# EasyEDA schematic SCH_ymu762 MegaMod_2022-10-14.json

## Sheets
1 Main: TITLE: Sheet_1; REV: 1.0; Date: 2021-11-16; Sheet: 1/1; Company: Your Company
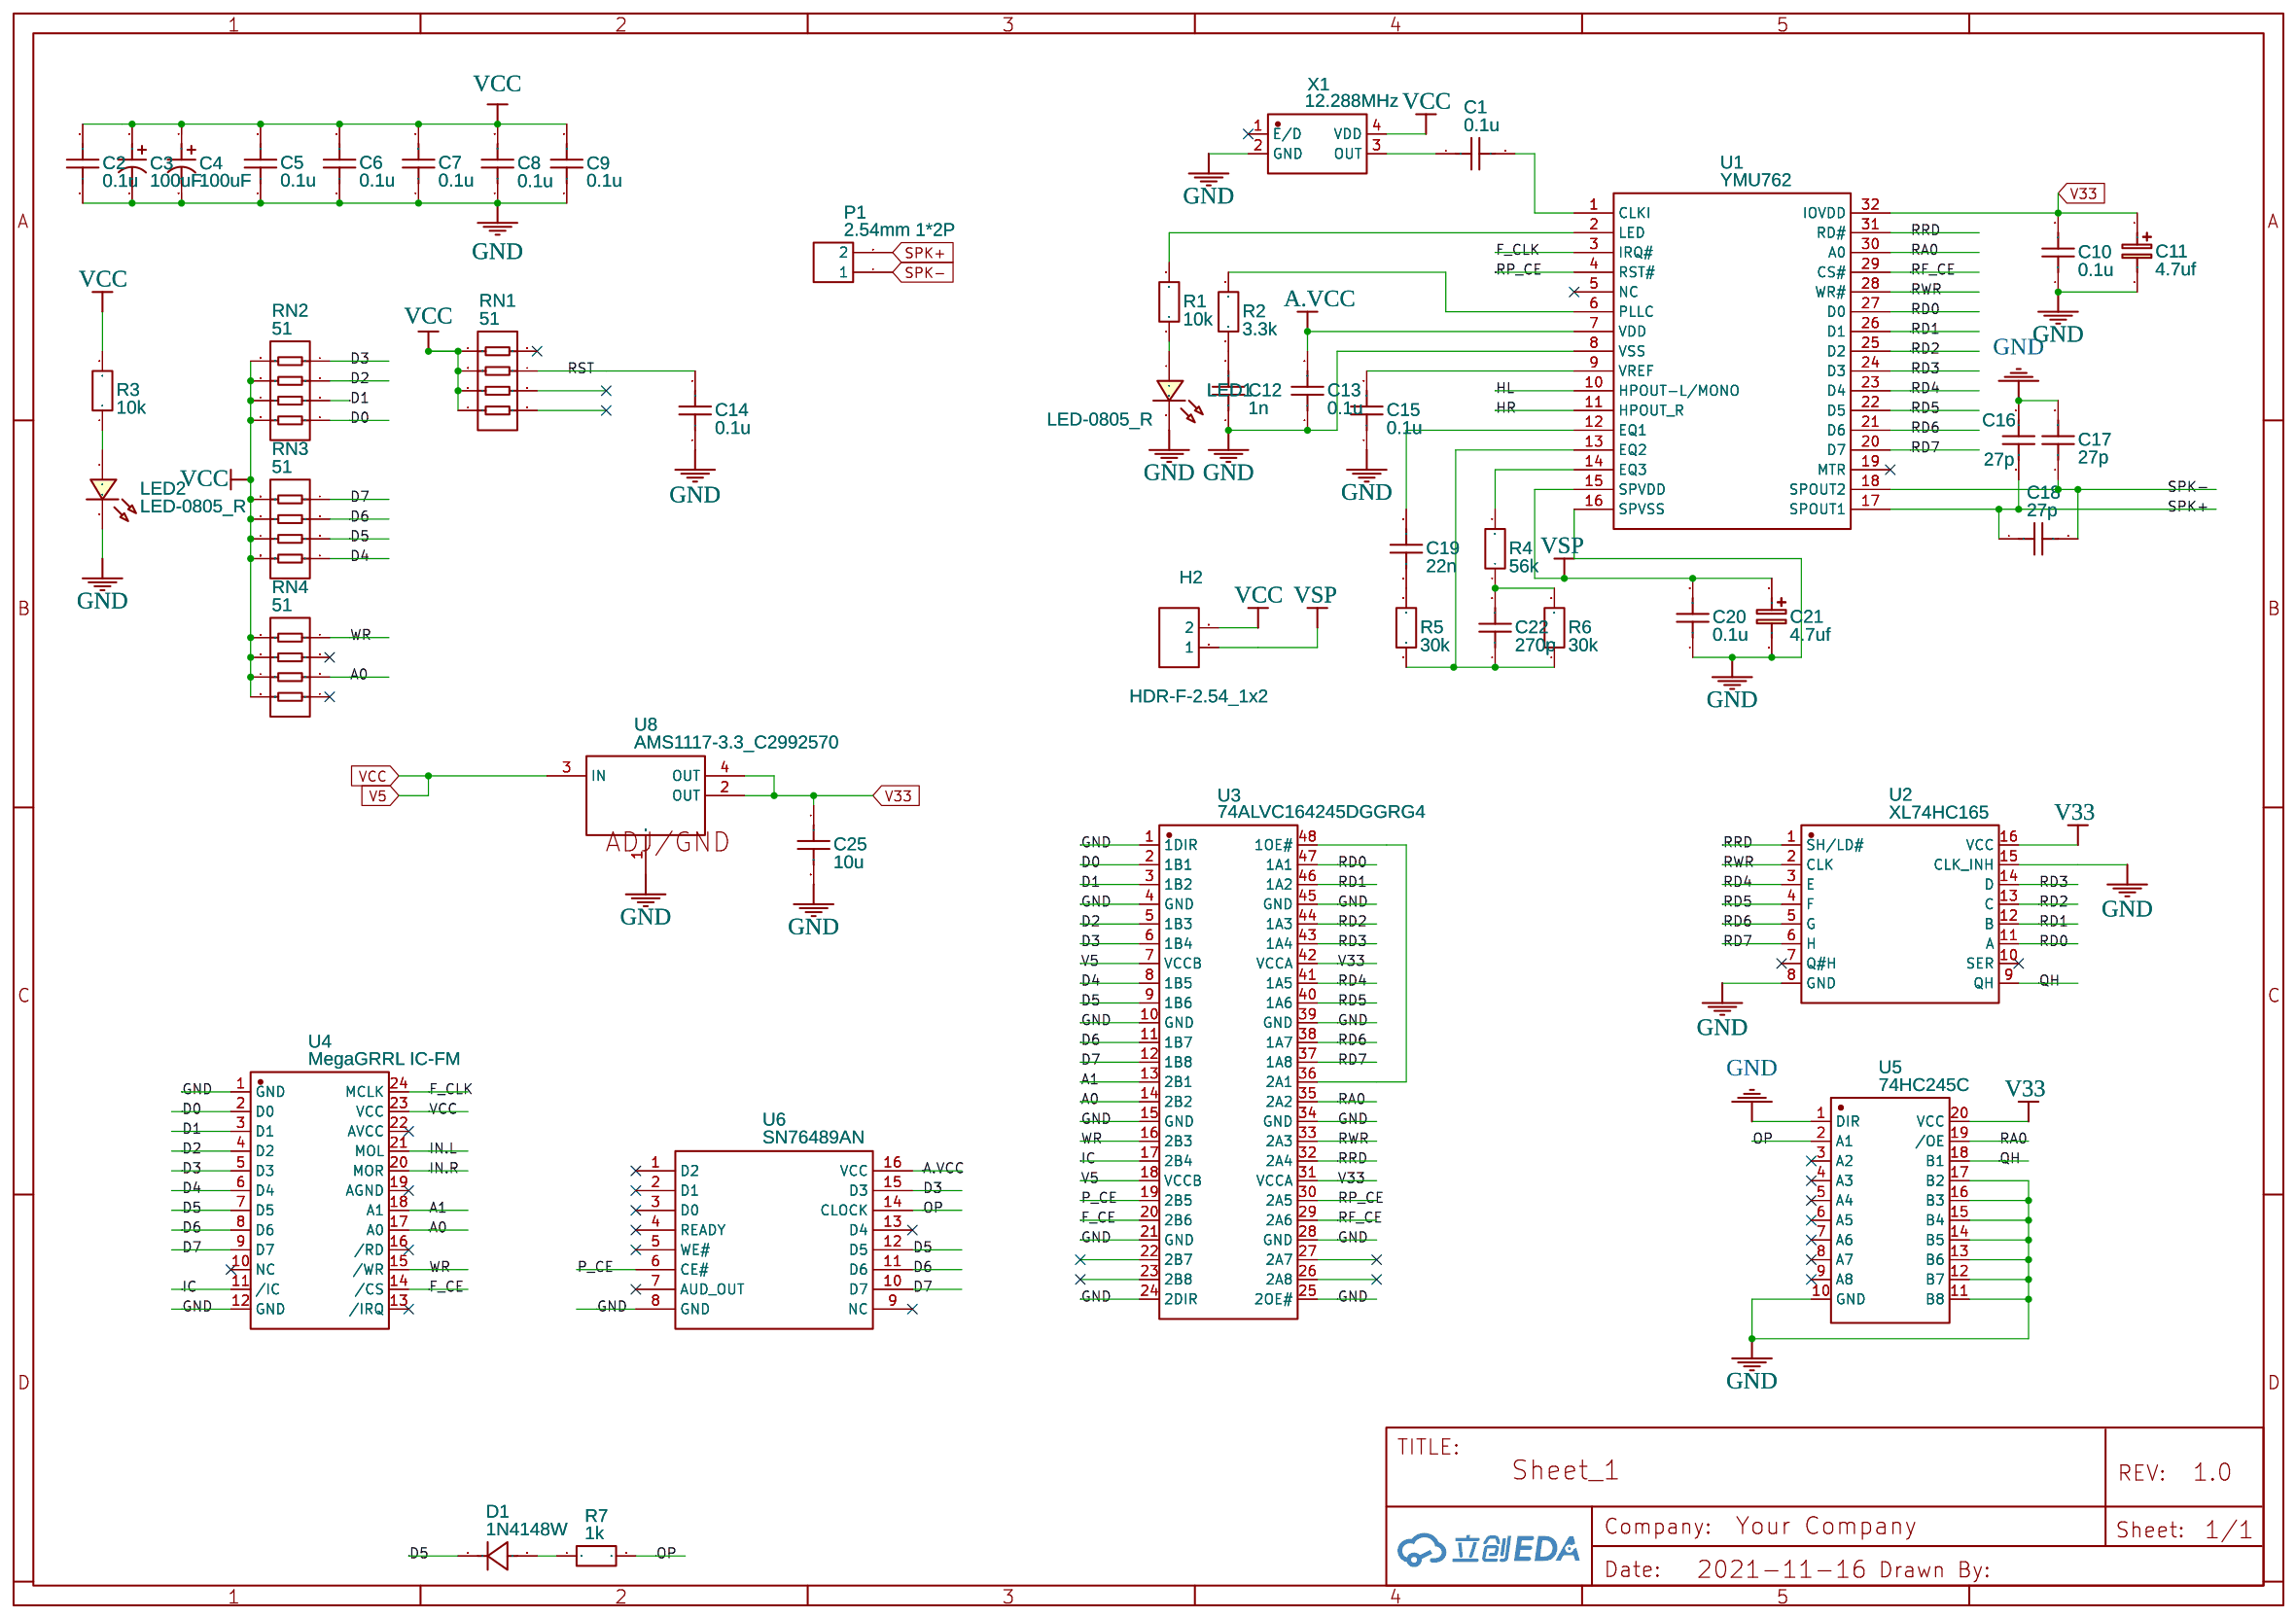
[diagram p0: Main]
2 OUT: TITLE: Sheet_2; Date: 2022-10-14; Drawn By: Denjhang
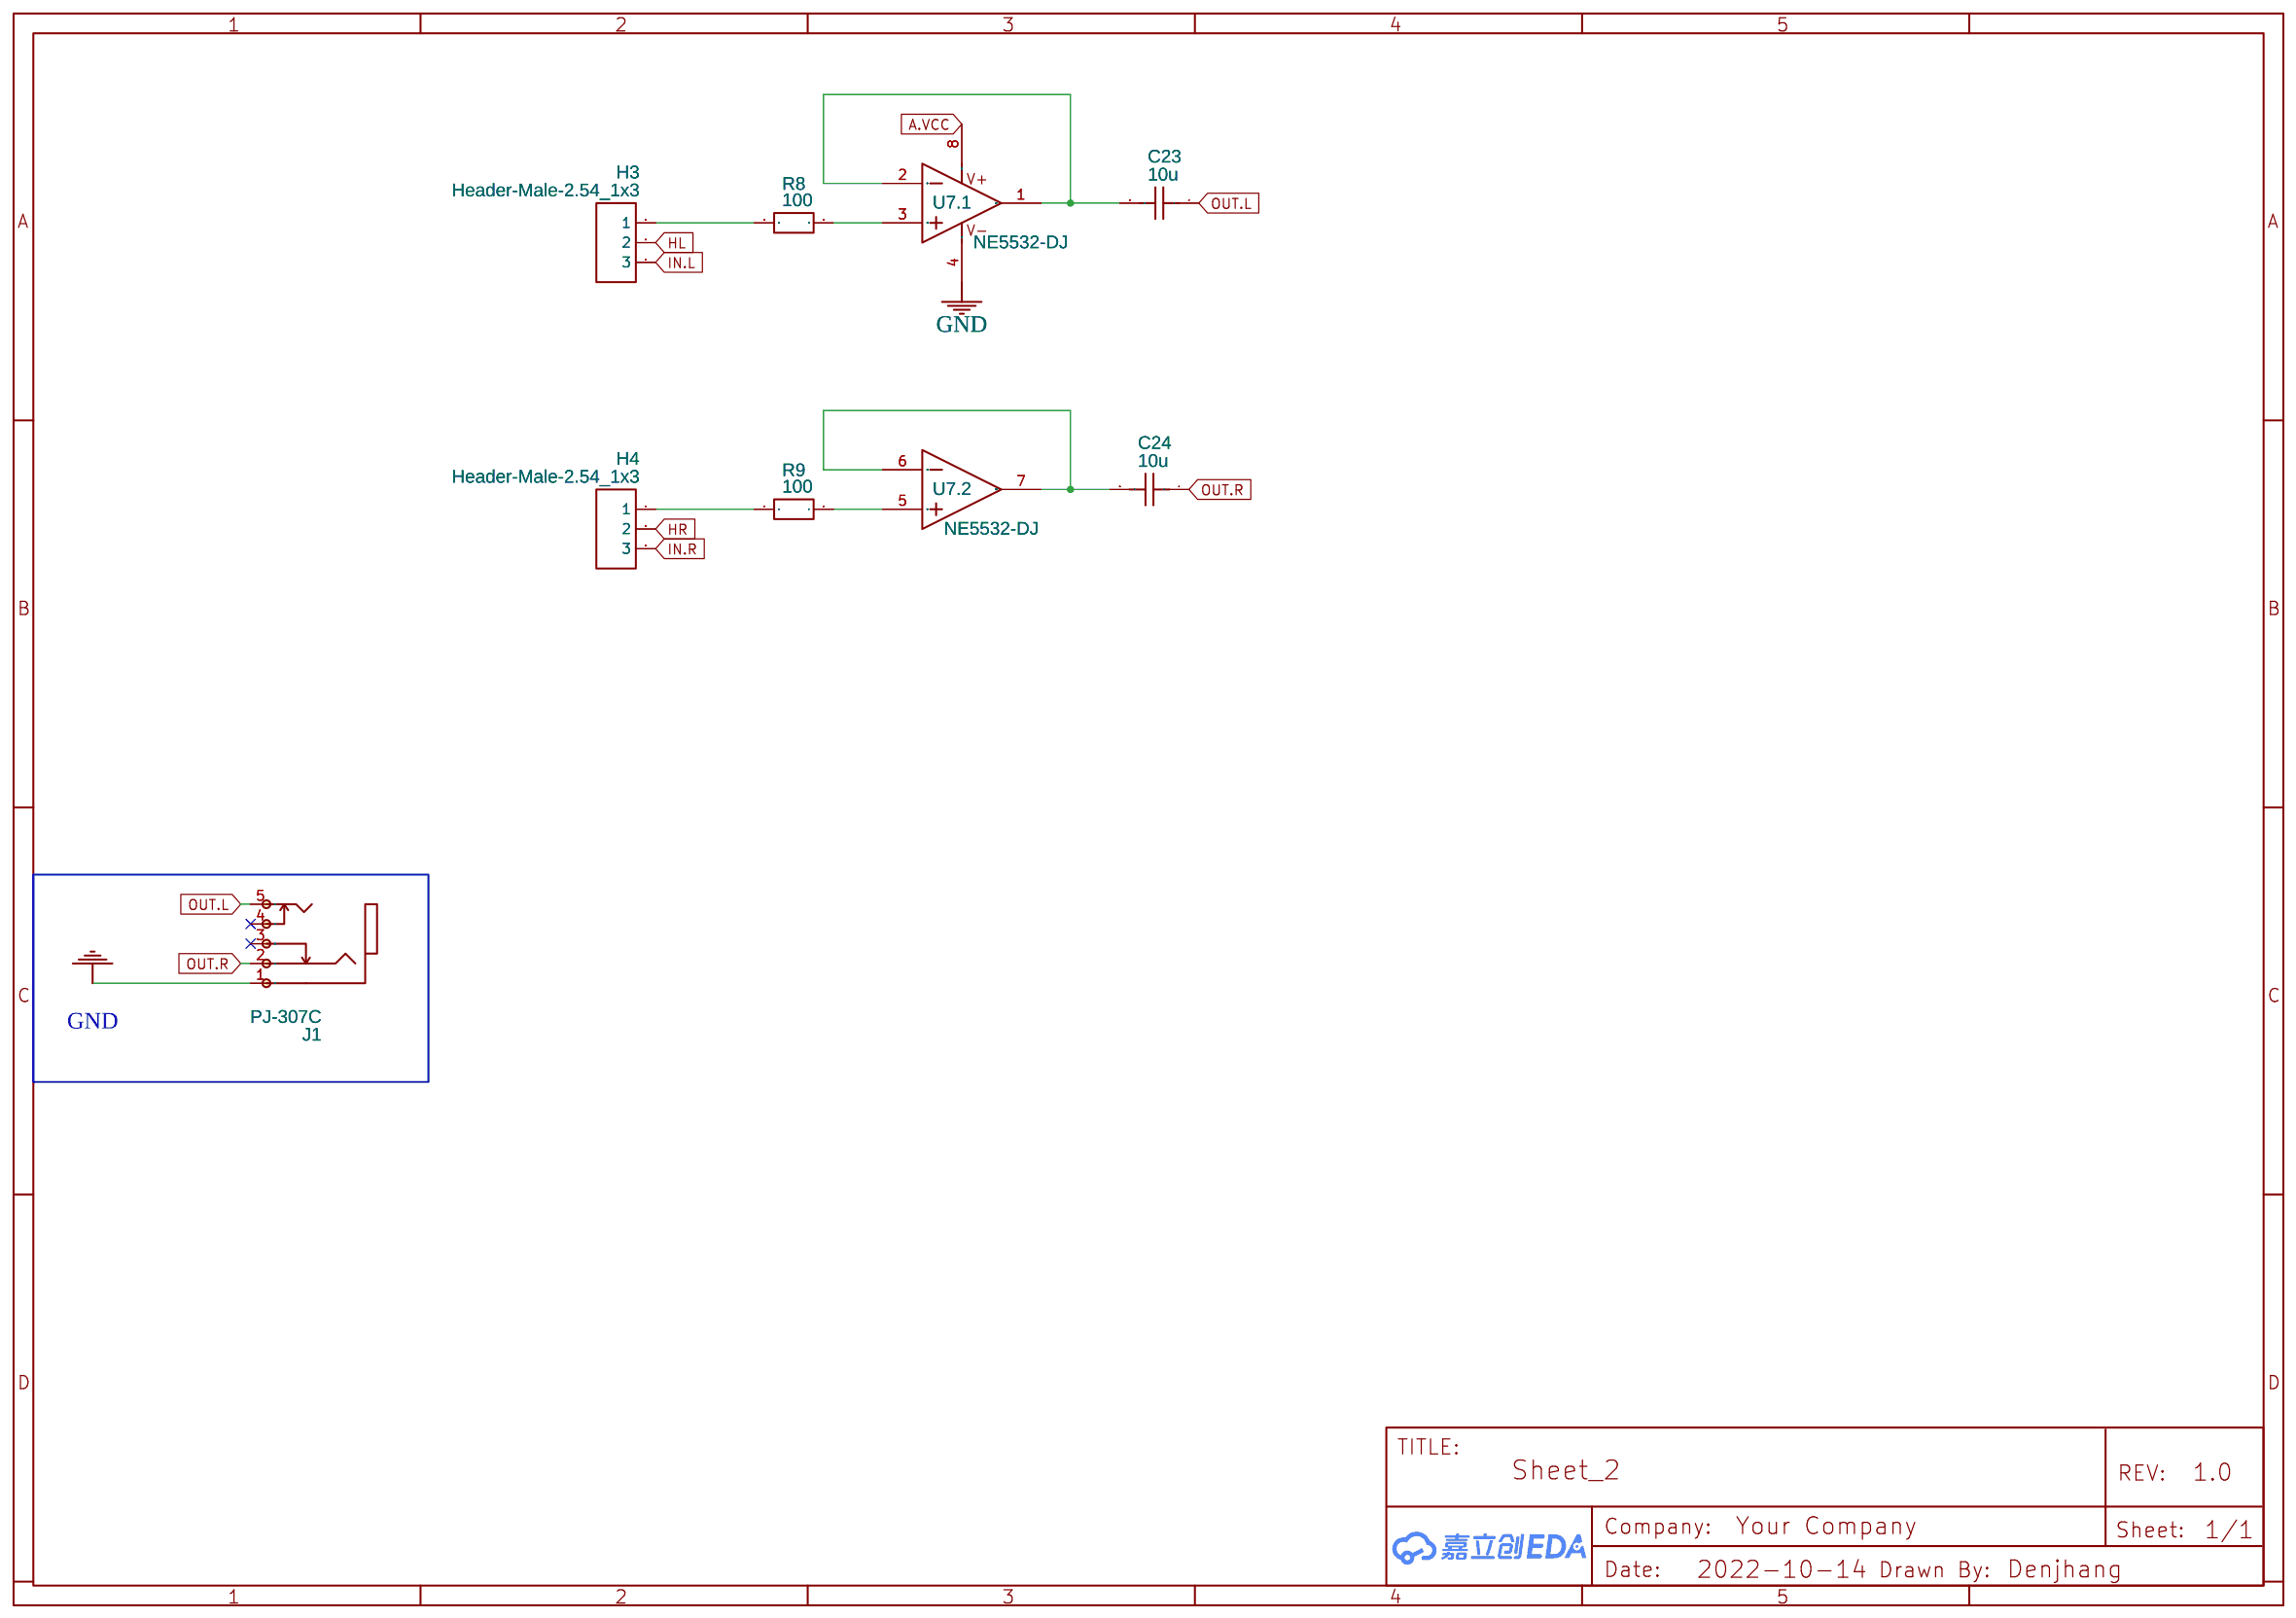
[diagram p1: OUT]

## Parts
sheet Main
C1  0.1u  [C0805]
C2  0.1u  [C0805]
C3  100uF  [CAP-SMD_L6.6-W6.6]
C4  100uF  [CAP-SMD_L6.6-W6.6]
C5  0.1u  [C0805]
C6  0.1u  [C0805]
C7  0.1u  [C0805]
C8  0.1u  [C0805]
C9  0.1u  [C0805]
C10  0.1u  [C0805]
C11  4.7uf  [C1206]
C12  1n  [C0805]
C13  0.1u  [C0805]
C14  0.1u  [C0805]
C15  0.1u  [C0805]
C16  27p  [C0805]
C17  27p  [C0805]
C18  27p  [C0805]
C19  22n  [C0805]
C20  0.1u  [C0805]
C21  4.7uf  [C1206]
C22  270p  [C0805]
C25  10u  [C0805]
D1  1N4148W  [SOD-123_L2.8-W1.8-LS3.7-RD]
H2  HDR-F-2.54_1x2  [JP]
LED1  LED-0805_R  [LED0805_RED]
LED2  LED-0805_R  [LED0805_RED]
P1  2.54mm 1*2P  [HDR-TH_2P-P2.54-V-M]
R1  10k  [R0805]
R2  3.3k  [R0805]
R3  10k  [R0805]
R4  56k  [R0805]
R5  30k  [R0805]
R6  30k  [R0805]
R7  1k  [R0805]
RN1  51  [RES-ARRAY-SMD_8P-L3.2-W1.6-P0.80-BL-1]
RN2  51  [RES-ARRAY-SMD_8P-L3.2-W1.6-P0.80-BL-1]
RN3  51  [RES-ARRAY-SMD_8P-L3.2-W1.6-P0.80-BL-1]
RN4  51  [RES-ARRAY-SMD_8P-L3.2-W1.6-P0.80-BL-1]
U1  YMU762  [C-PK32QP-2]
U2  XL74HC165  [SOP-16_L9.9-W3.9-P1.27-LS6.1-BL]
U3  74ALVC164245DGGRG4  [TSSOP-48_L12.5-W6.1-P0.50-LS8.1-BL]
U4  MegaGRRL IC-FM  [DIP-24_L32.0-W13.8-P2.54-LS15.6-BL]
U5  74HC245C  [TSSOP-20_L6.5-W4.4-P0.65-LS6.4-BL]
U6  SN76489AN  [DIP-16_L20.4-W5.8-P2.54-LS7.6-BL]
U8  AMS1117-3.3_C2992570  [SOT-223-3_L6.4-W3.5-P2.30-LS7.0-BR]
X1  12.288MHz  [OSC-SMD_4P-L7.0-W5.0-BL]
sheet OUT
C23  10u  [C0805]
C24  10u  [C0805]
H3  Header-Male-2.54_1x3  [HDR-TH_3P-P2.54-V-M-1]
H4  Header-Male-2.54_1x3  [HDR-TH_3P-P2.54-V-M-1]
J1  PJ-307C  [AUDIO-TH_PJ307C]
R8  100  [R0805]
R9  100  [R0805]
U7  NE5532-DJ  [DIP-8_L9.4-W6.4-P2.54-LS9.1-BL]  (sections 1,2)

## Library data of the parts
C1 C2 C5-C10 C12-C20 C22-C25 = C_0805_US: Contributor: LCEDA_Lib
C3 C4 = RVT100UF35V67RV0034: Supplier: LCSC; Supplier Part: C2836442; Manufacturer: KNSCHA(科尼盛); JLCPCB Part Class: Extended Part; Contributor: LCSC
C11 C21 = C_Tan_SMD_A_EU: Contributor: LCEDA_Lib
D1 = 1N4148W: Supplier: LCSC; Supplier Part: C1884539; Manufacturer: YFW佑风微; Contributor: Denjhang; JLCPCB Part Class: Extended Part
H2 = HDR-F-2.54_1x2: Supplier Part: C49661; Supplier: LCSC; Contributor: LCEDA_Lib
LED1 LED2 = LED-0805_R: Manufacturer: EVERLIGHT(台湾亿光); Manufacturer Part: 17-21SURC/S530-A3/TR8; Supplier Part: C72037; Contributor: LCEDA_Lib
P1 = 2.54mm 1*2P: Supplier: LCSC; Manufacturer: ReliaPro; Supplier Part: C36717; JLCPCB Part Class: Extended Part
R1-R9 = R_0805_EU: Contributor: LCEDA_Lib
RN1-RN4 = YC164-JR-0751RL: Supplier: LCSC; Supplier Part: C13474; Manufacturer: YAGEO; Contributor: LCSC; JLCPCB Part Class: Extended Part
U1 = YMU762: Contributor: re1mu
U2 = XL74HC165: Supplier: LCSC; Supplier Part: C609780; Manufacturer: XINLUDA; Contributor: LCSC; JLCPCB Part Class: Extended Part
U3 = 74ALVC164245DGGRG4: Supplier: LCSC; Supplier Part: C2677427; Manufacturer: TI(德州仪器); Contributor: LCSC; JLCPCB Part Class: Extended Part
U4 = MegaGRRL IC-FM: Supplier Part: C707077; Manufacturer: YAMAHA; Manufacturer Part: YM2612; Contributor: Denjhang; JLCPCB SMD: Yes; SMT Type: Extend
U5 = 74HC245C: Supplier: LCSC; Manufacturer: FM; Supplier Part: C126198; JLCPCB Part Class: Extended Part
U6 = SN76489AN: Manufacturer: Texas Instruments; Contributor: re1mu
U8 = AMS1117-3.3_C2992570: Supplier: LCSC; Supplier Part: C2992570; Manufacturer: 国芯佳品; Manufacturer Part: AMS1117-3.3; link: https://atta.szlcsc.comnull; Contributor: lcsc; JLCPCB Part Class: Extended Part
X1 = OT705012.288MJBA4SL: Supplier: LCSC; Supplier Part: C669092; Manufacturer: Yangxing Tech; Contributor: LCSC
H3 H4 = Header-Male-2.54_1x3: Supplier: LCSC; Manufacturer: BOOMELE; Manufacturer Part: Header2.54mm 1*3P; Supplier Part: C49257; JLCPCB Part Class: Extended Part
J1 = PJ-307C: Supplier: LCSC; Manufacturer: BOOMELE; Supplier Part: C16684; JLCPCB Part Class: Extended Part
U7 = NE5532-DJ: tags: Audio Operational Amplifier; Supplier Part: C5326; Supplier: LCSC; Manufacturer: TI; Manufacturer Part: NE5532P; subpart_no: 1; image: http://image.lceda.cn/szlcsc/C5326.jpg; JLCPCB Part Class: Extended Part; Contributor: Denjhang

## Nets
GND: C2.1 C3.2 C4.2 C5.1 C6.1 C7.1 C8.1 C9.1 C10.1 C11.2 C12.1 C13.1 C14.1 C15.1 C16.1 C17.2 C20.1 C21.2 C25.2 J1.1 LED1.2 LED2.2 U1.8(VSS) U1.16(SPVSS) U2.8(GND) U2.15(CLK INH) U3.1(1DIR) U3.4(GND) U3.10(GND) U3.15(GND) U3.21(GND) U3.24(2DIR) U3.25(2OE#) U3.28(GND) U3.34(GND) U3.39(GND) U3.45(GND) U4.1(GND) U4.12(GND) U5.1(DIR) U5.10(GND) U5.11(B8) U5.12(B7) U5.13(B6) U5.14(B5) U5.15(B4) U5.16(B3) U5.17(B2) U6.8(GND) U7.4(VCC-) U8.1(ADJ/GND) X1.2(GND)
V5: C2.2 C3.1 C4.1 C5.2 C6.2 C7.2 C8.2 C9.2 H2.2 R3.2 RN1.1 RN1.2 RN1.3 RN1.4 RN2.5 RN2.6 RN2.7 RN2.8 RN3.5 RN3.6 RN3.7 RN3.8 RN4.5 RN4.6 RN4.7 RN4.8 U3.7(VCCB) U3.18(VCCB) U4.23(VCC) U8.3(IN) X1.4(VDD)
V33: C10.2 C11.1 C25.1 U1.32(IOVDD) U2.16(VCC) U3.31(VCCA) U3.42(VCCA) U5.20(VCC) U8.2(OUT) U8.4(OUT)
A0: RN4.2 U3.14(2B2) U4.17(A0)
A1: U3.13(2B1) U4.18(A1)
A.VCC: C13.2 U1.7(VDD) U6.16(VCC) U7.8(VCC+)
D0: RN2.1 U3.2(1B1) U4.2(D0)
D1: RN2.2 U3.3(1B2) U4.3(D1)
D2: RN2.3 U3.5(1B3) U4.4(D2)
D3: RN2.4 U3.6(1B4) U4.5(D3) U6.15(D3)
D4: RN3.1 U3.8(1B5) U4.6(D4)
D5: D1.1(K) RN3.2 U3.9(1B6) U4.7(D5) U6.12(D5)
D6: RN3.3 U3.11(1B7) U4.8(D6) U6.11(D6)
D7: RN3.4 U3.12(1B8) U4.9(D7) U6.10(D7)
F_CE: U3.20(2B6) U4.14(/CS)
F_CLK: U1.3(IRQ#) U4.24(MCLK)
HL: H3.2 U1.10(HPOUT-L/MONO)
HR: H4.2 U1.11(HPOUT_R)
IC: U3.17(2B4) U4.11(/IC)
IN.L: H3.3 U4.21(MOL)
IN.R: H4.3 U4.20(MOR)
OP: R7.2 U5.2(A1) U6.14(CLOCK)
OUT.L: C23.1 J1.5
OUT.R: C24.1 J1.2
P_CE: U3.19(2B5) U6.6(CE#)
QH: U2.9(QH) U5.18(B1)
RA0: U1.30(A0) U3.35(2A2) U5.19(/OE)
RD0: U1.27(D0) U2.11(A) U3.47(1A1)
RD1: U1.26(D1) U2.12(B) U3.46(1A2)
RD2: U1.25(D2) U2.13(C) U3.44(1A3)
RD3: U1.24(D3) U2.14(D) U3.43(1A4)
RD4: U1.23(D4) U2.3(E) U3.41(1A5)
RD5: U1.22(D5) U2.4(F) U3.40(1A6)
RD6: U1.21(D6) U2.5(G) U3.38(1A7)
RD7: U1.20(D7) U2.6(H) U3.37(1A8)
RF_CE: U1.29(CS#) U3.29(2A6)
RP_CE: U1.4(RST#) U3.30(2A5)
RRD: U1.31(RD#) U2.1(SH/LD#) U3.32(2A4)
RST: C14.2 RN1.7
RWR: U1.28(WR#) U2.2(CLK) U3.33(2A3)
SPK+: C16.2 C18.1 P1.2 U1.17(SPOUT1)
SPK-: C17.1 C18.2 P1.1 U1.18(SPOUT2)
VSP: C20.2 C21.1 H2.1 U1.15(SPVDD)
WR: RN4.4 U3.16(2B3) U4.15(/WR)
Net-(C1-1): C1.1 X1.3(OUT)
Net-(C1-2): C1.2 U1.1(CLKI)
Net-(C12-2): C12.2 R2.1
Net-(C15-2): C15.2 U1.9(VREF)
Net-(C19-1): C19.1 U1.12(EQ1)
Net-(C19-2): C19.2 R5.2
Net-(C22-1): C22.1 R5.1 R6.1 U1.13(EQ2)
Net-(C22-2): C22.2 R4.1 R6.2
Net-(C23-2): C23.2 U7.1(OUT1) U7.2(IN1-)
Net-(C24-2): C24.2 U7.6(IN2-) U7.7(OUT2)
Net-(D1-2): D1.2(A) R7.1
Net-(H3-1): H3.1 R8.1
Net-(H4-1): H4.1 R9.1
Net-(LED1-1): LED1.1 R1.1
Net-(LED2-1): LED2.1 R3.1
Net-(R1-2): R1.2 U1.2(LED)
Net-(R2-2): R2.2 U1.6(PLLC)
Net-(R4-2): R4.2 U1.14(EQ3)
Net-(R8-2): R8.2 U7.3(IN1+)
Net-(R9-2): R9.2 U7.5(IN2+)
Net-(U3-36): U3.36(2A1) U3.48(1OE#)

Not connected (* = marked no-connect by the designer): J1 3* 4*; RN1 5 6 8*; RN4 1* 3*; U1 5(NC)* 19(MTR)*; U2 7(Q#H)* 10(SER)*; U3 22(2B7) 23(2B8) 26(2A8) 27(2A7); U4 10(NC)* 13(/IRQ)* 16(/RD)* 19(AGND)* 22(AVCC)*; U5 3(A2)* 4(A3)* 5(A4)* 6(A5)* 7(A6)* 8(A7)* 9(A8)*; U6 1(D2)* 2(D1)* 3(D0)* 4(READY)* 5(WE#)* 7(AUD OUT)* 9(NC)* 13(D4)*; X1 1(E/D)*
